# Altium schematic sheet connectors.SchDoc
size 420 x 297 mm
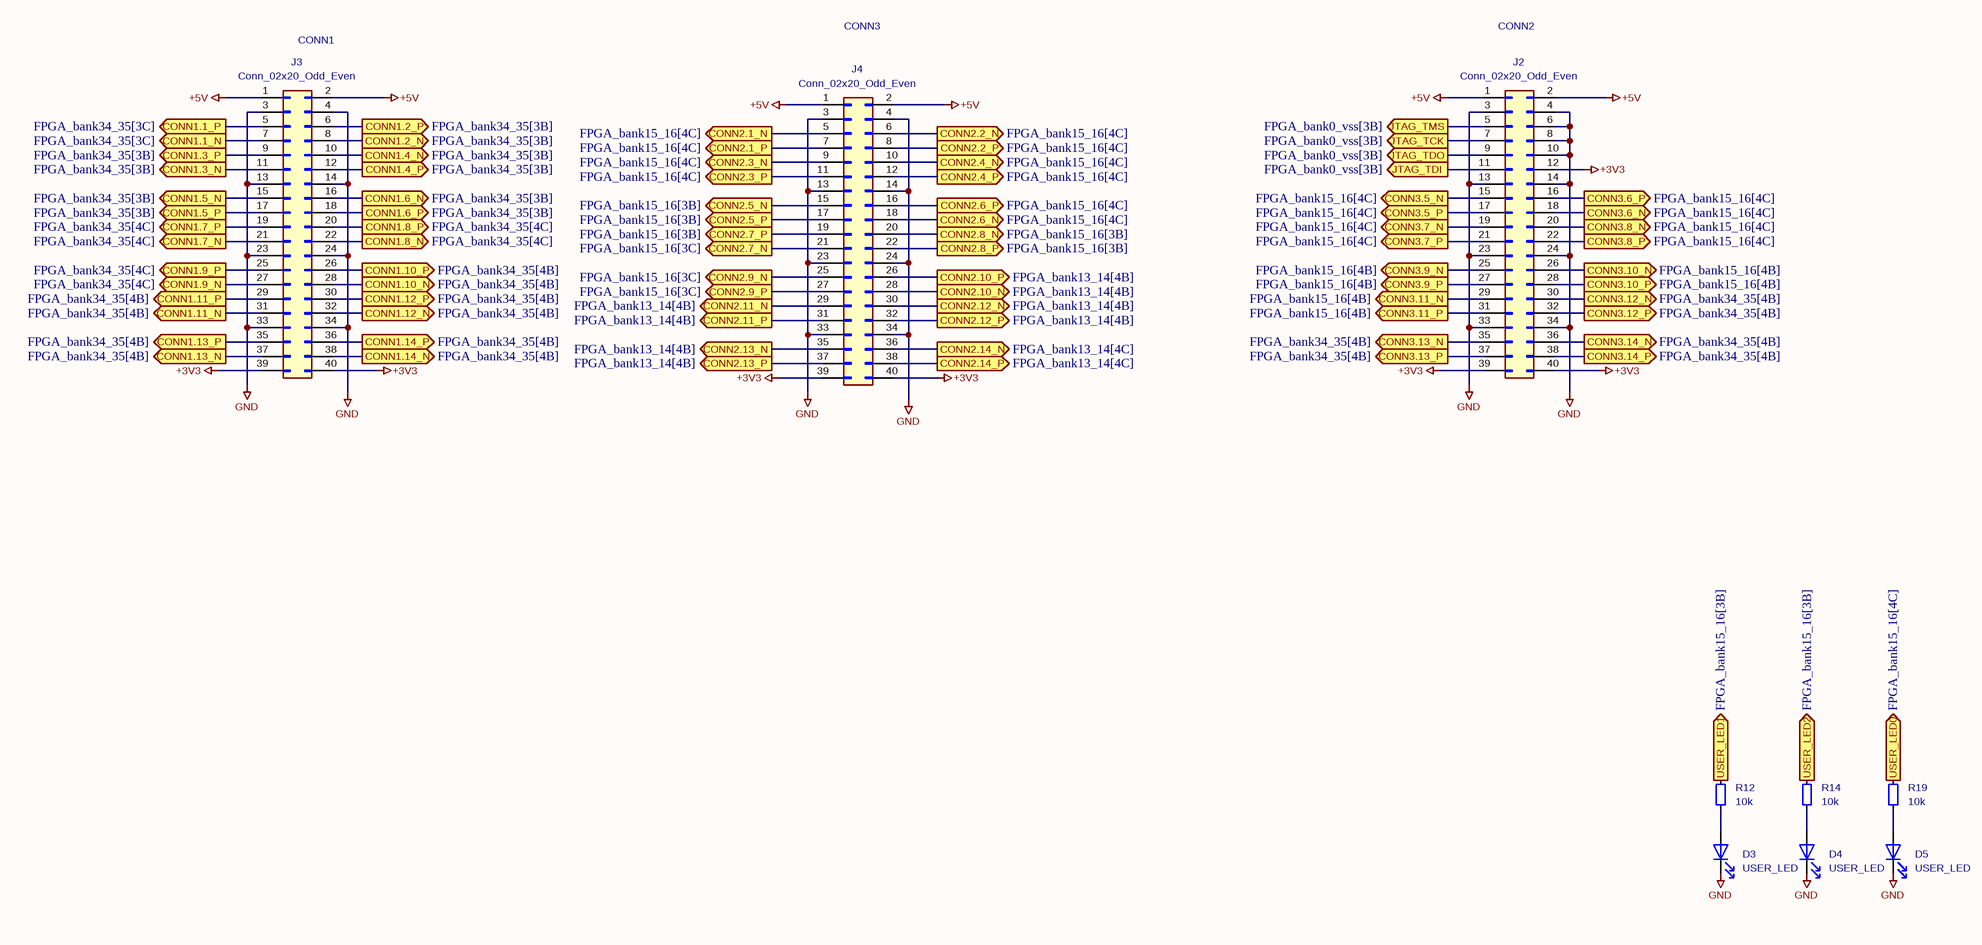
[diagram p0: connectors.SchDoc]

## Parts
D3  USER_LED  [LED_0603_1608Metric]
D4  USER_LED  [LED_0603_1608Metric]
D5  USER_LED  [LED_0603_1608Metric]
J2  Conn_02x20_Odd_Even  [SAMTEC_TFM-120-02-S-D-A]
J3  Conn_02x20_Odd_Even  [SAMTEC_TFM-120-02-S-D-A]
J4  Conn_02x20_Odd_Even  [SAMTEC_TFM-120-02-S-D-A]
R12  10k  [R_0402_1005Metric]
R14  10k  [R_0402_1005Metric]
R19  10k  [R_0402_1005Metric]

## Ports
CONN1.1_N (out, see FPGA_bank34_35[3C]), CONN1.1_P (out, see FPGA_bank34_35[3C]), CONN1.2_N (out, see FPGA_bank34_35[3B]), CONN1.2_P (out, see FPGA_bank34_35[3B]), CONN1.3_N (out, see FPGA_bank34_35[3B]), CONN1.3_P (out, see FPGA_bank34_35[3B]), CONN1.4_N (out, see FPGA_bank34_35[3B]), CONN1.4_P (out, see FPGA_bank34_35[3B]), CONN1.5_N (out, see FPGA_bank34_35[3B]), CONN1.5_P (out, see FPGA_bank34_35[3B]), CONN1.6_N (out, see FPGA_bank34_35[3B]), CONN1.6_P (out, see FPGA_bank34_35[3B]), CONN1.7_N (out, see FPGA_bank34_35[4C]), CONN1.7_P (out, see FPGA_bank34_35[4C]), CONN1.8_N (out, see FPGA_bank34_35[4C]), CONN1.8_P (out, see FPGA_bank34_35[4C]), CONN1.9_N (out, see FPGA_bank34_35[4C]), CONN1.9_P (out, see FPGA_bank34_35[4C]), CONN1.10_N (out, see FPGA_bank34_35[4B]), CONN1.10_P (out, see FPGA_bank34_35[4B]), CONN1.11_N (out, see FPGA_bank34_35[4B]), CONN1.11_P (out, see FPGA_bank34_35[4B]), CONN1.12_N (out, see FPGA_bank34_35[4B]), CONN1.12_P (out, see FPGA_bank34_35[4B]), CONN1.13_N (out, see FPGA_bank34_35[4B]), CONN1.13_P (out, see FPGA_bank34_35[4B]), CONN1.14_N (out, see FPGA_bank34_35[4B]), CONN1.14_P (out, see FPGA_bank34_35[4B]), CONN2.1_N (out, see FPGA_bank15_16[4C]), CONN2.1_P (out, see FPGA_bank15_16[4C]), CONN2.2_N (out, see FPGA_bank15_16[4C]), CONN2.2_P (out, see FPGA_bank15_16[4C]), CONN2.3_N (out, see FPGA_bank15_16[4C]), CONN2.3_P (out, see FPGA_bank15_16[4C]), CONN2.4_N (out, see FPGA_bank15_16[4C]), CONN2.4_P (out, see FPGA_bank15_16[4C]), CONN2.5_N (out, see FPGA_bank15_16[3B]), CONN2.5_P (out, see FPGA_bank15_16[3B]), CONN2.6_N (out, see FPGA_bank15_16[4C]), CONN2.6_P (out, see FPGA_bank15_16[4C]), CONN2.7_N (out, see FPGA_bank15_16[3C]), CONN2.7_P (out, see FPGA_bank15_16[3B]), CONN2.8_N (out, see FPGA_bank15_16[3B]), CONN2.8_P (out, see FPGA_bank15_16[3B]), CONN2.9_N (out, see FPGA_bank15_16[3C]), CONN2.9_P (out, see FPGA_bank15_16[3C]), CONN2.10_N (out, see FPGA_bank13_14[4B]), CONN2.10_P (out, see FPGA_bank13_14[4B]), CONN2.11_N (out, see FPGA_bank13_14[4B]), CONN2.11_P (out, see FPGA_bank13_14[4B]), CONN2.12_N (out, see FPGA_bank13_14[4B]), CONN2.12_P (out, see FPGA_bank13_14[4B]), CONN2.13_N (out, see FPGA_bank13_14[4B]), CONN2.13_P (out, see FPGA_bank13_14[4B]), CONN2.14_N (out, see FPGA_bank13_14[4C]), CONN2.14_P (out, see FPGA_bank13_14[4C]), CONN3.5_N (out, see FPGA_bank15_16[4C]), CONN3.5_P (out, see FPGA_bank15_16[4C]), CONN3.6_N (out, see FPGA_bank15_16[4C]), CONN3.6_P (out, see FPGA_bank15_16[4C]), CONN3.7_N (out, see FPGA_bank15_16[4C]), CONN3.7_P (out, see FPGA_bank15_16[4C]), CONN3.8_N (out, see FPGA_bank15_16[4C]), CONN3.8_P (out, see FPGA_bank15_16[4C]), CONN3.9_N (out, see FPGA_bank15_16[4B]), CONN3.9_P (out, see FPGA_bank15_16[4B]), CONN3.10_N (out, see FPGA_bank15_16[4B]), CONN3.10_P (out, see FPGA_bank15_16[4B]), CONN3.11_N (out, see FPGA_bank15_16[4B]), CONN3.11_P (out, see FPGA_bank15_16[4B]), CONN3.12_N (out, see FPGA_bank34_35[4B]), CONN3.12_P (out, see FPGA_bank34_35[4B]), CONN3.13_N (out, see FPGA_bank34_35[4B]), CONN3.13_P (out, see FPGA_bank34_35[4B]), CONN3.14_N (out, see FPGA_bank34_35[4B]), CONN3.14_P (out, see FPGA_bank34_35[4B]), JTAG_TCK (out, see FPGA_bank0_vss[3B]), JTAG_TDI (out, see FPGA_bank0_vss[3B]), JTAG_TDO (out, see FPGA_bank0_vss[3B]), JTAG_TMS (out, see FPGA_bank0_vss[3B]), USER_LED0 (in, see FPGA_bank15_16[4C]), USER_LED1 (in, see FPGA_bank15_16[3B]), USER_LED2 (in, see FPGA_bank15_16[3B])

## Nets
+3V3: J2.12(Pin_12) J2.39(Pin_39) J2.40(Pin_40) J3.39(Pin_39) J3.40(Pin_40) J4.39(Pin_39) J4.40(Pin_40)
+5V: J2.1(Pin_1) J2.2(Pin_2) J3.1(Pin_1) J3.2(Pin_2) J4.1(Pin_1) J4.2(Pin_2)
GND: D3.1(K) D4.1(K) D5.1(K) J2.3(Pin_3) J2.4(Pin_4) J2.6(Pin_6) J2.8(Pin_8) J2.10(Pin_10) J2.13(Pin_13) J2.14(Pin_14) J2.23(Pin_23) J2.24(Pin_24) J2.33(Pin_33) J2.34(Pin_34) J3.3(Pin_3) J3.4(Pin_4) J3.13(Pin_13) J3.14(Pin_14) J3.23(Pin_23) J3.24(Pin_24) J3.33(Pin_33) J3.34(Pin_34) J4.3(Pin_3) J4.4(Pin_4) J4.13(Pin_13) J4.14(Pin_14) J4.23(Pin_23) J4.24(Pin_24) J4.33(Pin_33) J4.34(Pin_34)
CONN1.1_N: J3.7(Pin_7) ; port CONN1.1_N
CONN1.1_P: J3.5(Pin_5) ; port CONN1.1_P
CONN1.2_N: J3.8(Pin_8) ; port CONN1.2_N
CONN1.2_P: J3.6(Pin_6) ; port CONN1.2_P
CONN1.3_N: J3.11(Pin_11) ; port CONN1.3_N
CONN1.3_P: J3.9(Pin_9) ; port CONN1.3_P
CONN1.4_N: J3.10(Pin_10) ; port CONN1.4_N
CONN1.4_P: J3.12(Pin_12) ; port CONN1.4_P
CONN1.5_N: J3.15(Pin_15) ; port CONN1.5_N
CONN1.5_P: J3.17(Pin_17) ; port CONN1.5_P
CONN1.6_N: J3.16(Pin_16) ; port CONN1.6_N
CONN1.6_P: J3.18(Pin_18) ; port CONN1.6_P
CONN1.7_N: J3.21(Pin_21) ; port CONN1.7_N
CONN1.7_P: J3.19(Pin_19) ; port CONN1.7_P
CONN1.8_N: J3.22(Pin_22) ; port CONN1.8_N
CONN1.8_P: J3.20(Pin_20) ; port CONN1.8_P
CONN1.9_N: J3.27(Pin_27) ; port CONN1.9_N
CONN1.9_P: J3.25(Pin_25) ; port CONN1.9_P
CONN1.10_N: J3.28(Pin_28) ; port CONN1.10_N
CONN1.10_P: J3.26(Pin_26) ; port CONN1.10_P
CONN1.11_N: J3.31(Pin_31) ; port CONN1.11_N
CONN1.11_P: J3.29(Pin_29) ; port CONN1.11_P
CONN1.12_N: J3.32(Pin_32) ; port CONN1.12_N
CONN1.12_P: J3.30(Pin_30) ; port CONN1.12_P
CONN1.13_N: J3.37(Pin_37) ; port CONN1.13_N
CONN1.13_P: J3.35(Pin_35) ; port CONN1.13_P
CONN1.14_N: J3.38(Pin_38) ; port CONN1.14_N
CONN1.14_P: J3.36(Pin_36) ; port CONN1.14_P
CONN2.1_N: J4.5(Pin_5) ; port CONN2.1_N
CONN2.1_P: J4.7(Pin_7) ; port CONN2.1_P
CONN2.2_N: J4.6(Pin_6) ; port CONN2.2_N
CONN2.2_P: J4.8(Pin_8) ; port CONN2.2_P
CONN2.3_N: J4.9(Pin_9) ; port CONN2.3_N
CONN2.3_P: J4.11(Pin_11) ; port CONN2.3_P
CONN2.4_N: J4.10(Pin_10) ; port CONN2.4_N
CONN2.4_P: J4.12(Pin_12) ; port CONN2.4_P
CONN2.5_N: J4.15(Pin_15) ; port CONN2.5_N
CONN2.5_P: J4.17(Pin_17) ; port CONN2.5_P
CONN2.6_N: J4.18(Pin_18) ; port CONN2.6_N
CONN2.6_P: J4.16(Pin_16) ; port CONN2.6_P
CONN2.7_N: J4.21(Pin_21) ; port CONN2.7_N
CONN2.7_P: J4.19(Pin_19) ; port CONN2.7_P
CONN2.8_N: J4.20(Pin_20) ; port CONN2.8_N
CONN2.8_P: J4.22(Pin_22) ; port CONN2.8_P
CONN2.9_N: J4.25(Pin_25) ; port CONN2.9_N
CONN2.9_P: J4.27(Pin_27) ; port CONN2.9_P
CONN2.10_N: J4.28(Pin_28) ; port CONN2.10_N
CONN2.10_P: J4.26(Pin_26) ; port CONN2.10_P
CONN2.11_N: J4.29(Pin_29) ; port CONN2.11_N
CONN2.11_P: J4.31(Pin_31) ; port CONN2.11_P
CONN2.12_N: J4.30(Pin_30) ; port CONN2.12_N
CONN2.12_P: J4.32(Pin_32) ; port CONN2.12_P
CONN2.13_N: J4.35(Pin_35) ; port CONN2.13_N
CONN2.13_P: J4.37(Pin_37) ; port CONN2.13_P
CONN2.14_N: J4.36(Pin_36) ; port CONN2.14_N
CONN2.14_P: J4.38(Pin_38) ; port CONN2.14_P
CONN3.5_N: J2.15(Pin_15) ; port CONN3.5_N
CONN3.5_P: J2.17(Pin_17) ; port CONN3.5_P
CONN3.6_N: J2.18(Pin_18) ; port CONN3.6_N
CONN3.6_P: J2.16(Pin_16) ; port CONN3.6_P
CONN3.7_N: J2.19(Pin_19) ; port CONN3.7_N
CONN3.7_P: J2.21(Pin_21) ; port CONN3.7_P
CONN3.8_N: J2.20(Pin_20) ; port CONN3.8_N
CONN3.8_P: J2.22(Pin_22) ; port CONN3.8_P
CONN3.9_N: J2.25(Pin_25) ; port CONN3.9_N
CONN3.9_P: J2.27(Pin_27) ; port CONN3.9_P
CONN3.10_N: J2.26(Pin_26) ; port CONN3.10_N
CONN3.10_P: J2.28(Pin_28) ; port CONN3.10_P
CONN3.11_N: J2.29(Pin_29) ; port CONN3.11_N
CONN3.11_P: J2.31(Pin_31) ; port CONN3.11_P
CONN3.12_N: J2.30(Pin_30) ; port CONN3.12_N
CONN3.12_P: J2.32(Pin_32) ; port CONN3.12_P
CONN3.13_N: J2.35(Pin_35) ; port CONN3.13_N
CONN3.13_P: J2.37(Pin_37) ; port CONN3.13_P
CONN3.14_N: J2.36(Pin_36) ; port CONN3.14_N
CONN3.14_P: J2.38(Pin_38) ; port CONN3.14_P
JTAG_TCK: J2.7(Pin_7) ; port JTAG_TCK
JTAG_TDI: J2.11(Pin_11) ; port JTAG_TDI
JTAG_TDO: J2.9(Pin_9) ; port JTAG_TDO
JTAG_TMS: J2.5(Pin_5) ; port JTAG_TMS
USER_LED0: R19.1 ; port USER_LED0
USER_LED1: R12.1 ; port USER_LED1
USER_LED2: R14.1 ; port USER_LED2
NetD3_2: D3.2(A) R12.2
NetD4_2: D4.2(A) R14.2
NetD5_2: D5.2(A) R19.2

## Notes on the sheet
- CONN3
- CONN2
- (near J3) CONN1
- 1
- 2
- 3
- 4
- 5
- 6
- 7
- 8
- A
- B
- C
- D
- E
- Title:
- File: connectors.kicad_sch
- Sheet: /
- F
- KiCad E.D.A.  kicad (5.1.4)-1
- Size: A3
- Date:
- Rev:
- Id: 1/1

## Library data of the parts
D3-D5 = LED: JLCPCB: C40378; Value: USER_LED; Footprint: LED_SMD:LED_0603_1608Metric
R12 R14 R19 = R_Small: JLCPCB: C328298; Value: 10k; Footprint: Resistor_SMD:R_0402_1005Metric
J2-J4 = Conn_02x20_Odd_Even: JLCPCB: C2881867; Value: Conn_02x20_Odd_Even; Footprint: samtec:SAMTEC_TFM-120-02-S-D-A